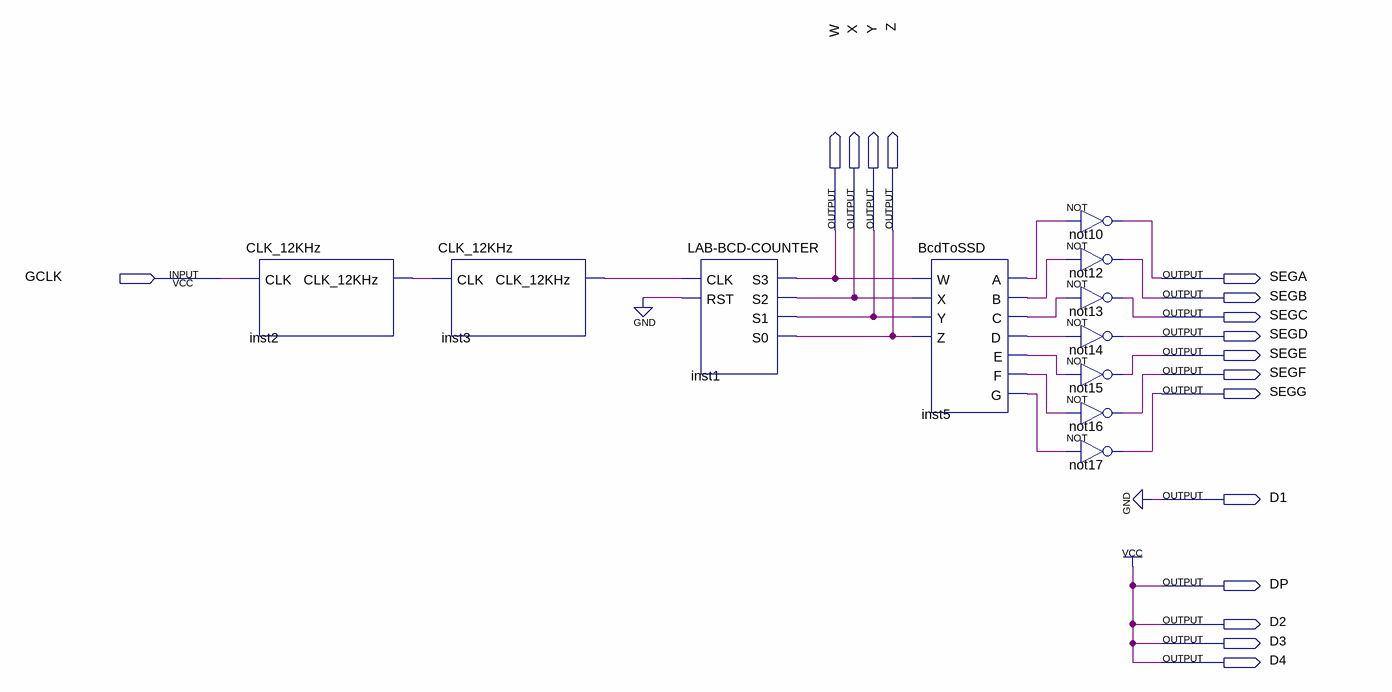
[diagram p0: schematic sheet]
// Quartus schematic BCDCounterDisplay.bdf as structural Verilog: 11 symbols, 17 pins
module BCDCounterDisplay (
  input  GCLK,
  output W,
  output X,
  output Y,
  output Z,
  output SEGA,
  output SEGB,
  output SEGC,
  output SEGD,
  output SEGE,
  output SEGF,
  output SEGG,
  output D1,
  output DP,
  output D2,
  output D3,
  output D4
);

  wire inst2_clk_12khz, inst3_clk_12khz, inst5_a, inst5_b, inst5_c, inst5_d, inst5_e, inst5_f, inst5_g;

  CLK_12KHz inst2 (.CLK(GCLK), .CLK_12KHz(inst2_clk_12khz));
  CLK_12KHz inst3 (.CLK(inst2_clk_12khz), .CLK_12KHz(inst3_clk_12khz));
  \LAB-BCD-COUNTER  inst1 (.CLK(inst3_clk_12khz), .RST(1'b0), .S3(W), .S2(X), .S1(Y), .S0(Z));
  BcdToSSD inst5 (
    .W(W), .X(X), .Y(Y), .Z(Z), .A(inst5_a), .B(inst5_b), .C(inst5_c), .D(inst5_d), .E(inst5_e), .F(inst5_f),
    .G(inst5_g));
  not not10 (SEGA, inst5_a);
  not not12 (SEGB, inst5_b);
  not not13 (SEGC, inst5_c);
  not not14 (SEGD, inst5_d);
  not not15 (SEGE, inst5_e);
  not not16 (SEGF, inst5_f);
  not not17 (SEGG, inst5_g);

  assign D1 = 1'b0;
  assign D2 = 1'b1;
  assign D3 = 1'b1;
  assign D4 = 1'b1;
  assign DP = 1'b1;
endmodule
